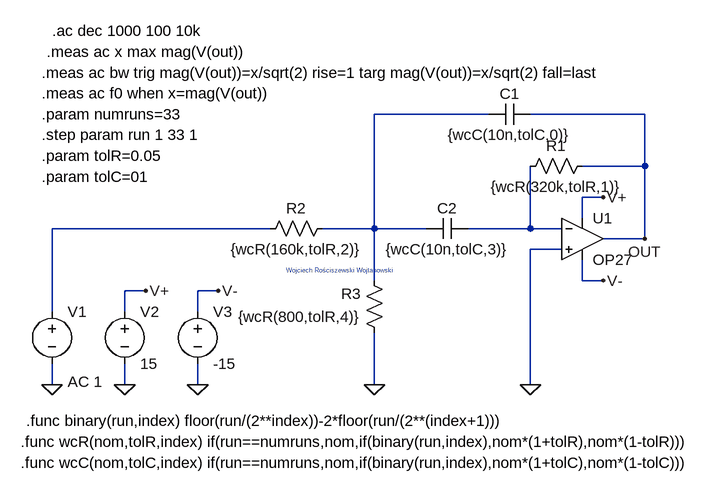
[diagram p0: schematic Band-pass filter WC.asc]
Band-pass filter WC.asc, the LTspice schematic file:
Version 4
SHEET 1 880 680
WIRE 368 64 192 64
WIRE 608 64 432 64
WIRE 608 144 608 64
WIRE 608 144 512 144
WIRE 544 192 512 192
WIRE 512 224 512 192
WIRE 32 240 -304 240
WIRE 192 240 192 64
WIRE 192 240 112 240
WIRE 272 240 192 240
WIRE 432 240 432 144
WIRE 432 240 336 240
WIRE 480 240 432 240
WIRE 608 256 608 144
WIRE 608 256 544 256
WIRE 480 272 432 272
WIRE 192 320 192 240
WIRE 512 320 512 288
WIRE 544 320 512 320
WIRE -160 336 -192 336
WIRE -48 336 -80 336
WIRE -304 368 -304 240
WIRE -192 368 -192 336
WIRE -80 368 -80 336
WIRE -304 480 -304 448
WIRE -192 480 -192 448
WIRE -80 480 -80 448
WIRE 192 480 192 400
WIRE 432 480 432 272
FLAG 192 480 0
FLAG -80 480 0
FLAG -192 480 0
FLAG -304 480 0
FLAG 432 480 0
FLAG 608 256 OUT
FLAG 544 192 V+
FLAG 544 320 V-
FLAG -160 336 V+
FLAG -48 336 V-
SYMBOL cap 432 48 R90
WINDOW 0 0 32 VBottom 2
WINDOW 3 32 32 VTop 2
SYMATTR InstName C1
SYMATTR Value {wcC(10n,tolC,0)}
SYMBOL res 528 128 R90
WINDOW 0 0 56 VBottom 2
WINDOW 3 32 56 VTop 2
SYMATTR InstName R1
SYMATTR Value {wcR(320k,tolR,1)}
SYMBOL cap 336 224 R90
WINDOW 0 0 32 VBottom 2
WINDOW 3 32 32 VTop 2
SYMATTR InstName C2
SYMATTR Value {wcC(10n,tolC,3)}
SYMBOL res 128 224 R90
WINDOW 0 0 56 VBottom 2
WINDOW 3 32 56 VTop 2
SYMATTR InstName R2
SYMATTR Value {wcR(160k,tolR,2)}
SYMBOL res 208 416 R180
WINDOW 0 36 76 Left 2
WINDOW 3 36 40 Left 2
SYMATTR InstName R3
SYMATTR Value {wcR(800,tolR,4)}
SYMBOL voltage -304 352 R0
WINDOW 123 24 124 Left 2
WINDOW 39 0 0 Left 0
SYMATTR Value2 AC 1
SYMATTR InstName V1
SYMATTR Value ""
SYMBOL voltage -192 352 R0
SYMATTR InstName V2
SYMATTR Value 15
SYMBOL voltage -80 352 R0
SYMATTR InstName V3
SYMATTR Value -15
SYMBOL Opamps\\OP27 512 192 R0
SYMATTR InstName U1
TEXT -304 -64 Left 2 !.ac dec 1000 100 10k
TEXT -312 -32 Left 2 !.meas ac x max mag(V(out))
TEXT -320 0 Left 2 !.meas ac bw trig mag(V(out))=x/sqrt(2) rise=1 targ mag(V(out))=x/sqrt(2) fall=last
TEXT -320 32 Left 2 !.meas ac f0 when x=mag(V(out))
TEXT 56 304 Left 0 ;Wojciech Rościszewski Wojtanowski
TEXT -320 96 Left 2 !.step param run 1 33 1
TEXT -320 128 Left 2 !.param tolR=0.05
TEXT -320 160 Left 2 !.param tolC=01
TEXT -320 64 Left 2 !.param numruns=33
TEXT -344 536 Left 2 !.func binary(run,index) floor(run/(2**index))-2*floor(run/(2**(index+1)))
TEXT -352 568 Left 2 !.func wcR(nom,tolR,index) if(run==numruns,nom,if(binary(run,index),nom*(1+tolR),nom*(1-tolR)))
TEXT -352 600 Left 2 !.func wcC(nom,tolC,index) if(run==numruns,nom,if(binary(run,index),nom*(1+tolC),nom*(1-tolC)))

The netlist it stands for:
* Band-pass filter WC.asc
C1 OUT N001 {wcC(10n,tolC,0)}
R1 OUT N003 {wcR(320k,tolR,1)}
C2 N003 N001 {wcC(10n,tolC,3)}
R2 N001 N002 {wcR(160k,tolR,2)}
R3 0 N001 {wcR(800,tolR,4)}
V1 N002 0 AC 1
V2 V+ 0 15
V3 V- 0 -15
XU1 0 N003 V+ V- OUT OP27  ; pins In+ In- V+ V- OUT
.ac dec 1000 100 10k
.meas ac x max mag(V(out))
.meas ac bw trig mag(V(out))=x/sqrt(2) rise=1 targ mag(V(out))=x/sqrt(2) fall=last
.meas ac f0 when x=mag(V(out))
* Wojciech Rościszewski Wojtanowski
.step param run 1 33 1
.param tolR=0.05
.param tolC=01
.param numruns=33
.func binary(run,index) floor(run/(2**index))-2*floor(run/(2**(index+1)))
.func wcR(nom,tolR,index) if(run==numruns,nom,if(binary(run,index),nom*(1+tolR),nom*(1-tolR)))
.func wcC(nom,tolC,index) if(run==numruns,nom,if(binary(run,index),nom*(1+tolC),nom*(1-tolC)))
.lib ADI.lib
.backanno
.end